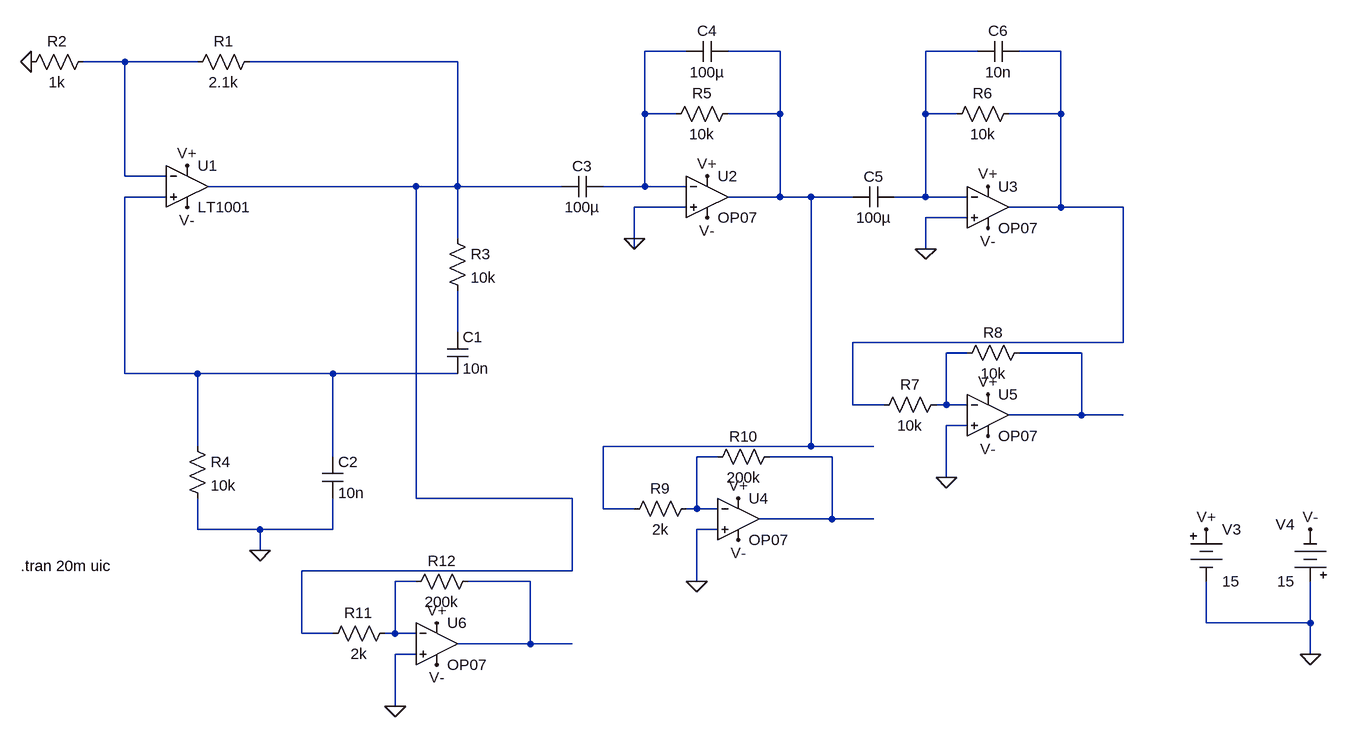
[diagram p0: schematic functiongenerator.asc]
functiongenerator.asc, the LTspice schematic file:
Version 4.1
SHEET 1 1992 964
WIRE 944 -64 880 -64
WIRE 1088 -64 1008 -64
WIRE 1392 -64 1312 -64
WIRE 1520 -64 1456 -64
WIRE 80 -48 16 -48
WIRE 192 -48 80 -48
WIRE 592 -48 272 -48
WIRE 880 32 880 -64
WIRE 928 32 880 32
WIRE 1088 32 1088 -64
WIRE 1088 32 1008 32
WIRE 1312 32 1312 -64
WIRE 1360 32 1312 32
WIRE 1520 32 1520 -64
WIRE 1520 32 1440 32
WIRE 80 128 80 -48
WIRE 144 128 80 128
WIRE 528 144 208 144
WIRE 592 144 592 -48
WIRE 592 144 528 144
WIRE 752 144 592 144
WIRE 880 144 880 32
WIRE 880 144 816 144
WIRE 944 144 880 144
WIRE 144 160 80 160
WIRE 1088 160 1088 32
WIRE 1088 160 1008 160
WIRE 1136 160 1088 160
WIRE 1200 160 1136 160
WIRE 1312 160 1312 32
WIRE 1312 160 1264 160
WIRE 1376 160 1312 160
WIRE 944 176 864 176
WIRE 1520 176 1520 32
WIRE 1520 176 1440 176
WIRE 1616 176 1520 176
WIRE 1376 192 1312 192
WIRE 592 224 592 144
WIRE 864 224 864 176
WIRE 864 240 864 224
WIRE 1312 240 1312 192
WIRE 592 368 592 304
WIRE 1616 384 1616 176
WIRE 1616 384 1200 384
WIRE 1376 400 1344 400
WIRE 1552 400 1456 400
WIRE 80 432 80 160
WIRE 192 432 80 432
WIRE 400 432 192 432
WIRE 592 432 400 432
WIRE 1200 480 1200 384
WIRE 1248 480 1200 480
WIRE 1344 480 1344 400
WIRE 1344 480 1328 480
WIRE 1376 480 1344 480
WIRE 1552 496 1552 400
WIRE 1552 496 1440 496
WIRE 1616 496 1552 496
WIRE 1376 512 1344 512
WIRE 192 544 192 432
WIRE 1136 544 1136 160
WIRE 1136 544 816 544
WIRE 1232 544 1136 544
WIRE 400 560 400 432
WIRE 992 560 960 560
WIRE 1168 560 1072 560
WIRE 1344 592 1344 512
WIRE 528 624 528 144
WIRE 768 624 528 624
WIRE 816 640 816 544
WIRE 864 640 816 640
WIRE 960 640 960 560
WIRE 960 640 944 640
WIRE 992 640 960 640
WIRE 1168 656 1168 560
WIRE 1168 656 1056 656
WIRE 1232 656 1168 656
WIRE 192 672 192 624
WIRE 288 672 192 672
WIRE 400 672 400 624
WIRE 400 672 288 672
WIRE 992 672 960 672
WIRE 288 704 288 672
WIRE 768 736 768 624
WIRE 768 736 352 736
WIRE 528 752 496 752
WIRE 704 752 608 752
WIRE 960 752 960 672
WIRE 1744 816 1744 752
WIRE 1904 816 1904 752
WIRE 1904 816 1744 816
WIRE 352 832 352 736
WIRE 400 832 352 832
WIRE 496 832 496 752
WIRE 496 832 480 832
WIRE 528 832 496 832
WIRE 704 848 704 752
WIRE 704 848 592 848
WIRE 768 848 704 848
WIRE 528 864 496 864
WIRE 1904 864 1904 816
WIRE 496 944 496 864
FLAG -64 -48 0
FLAG 288 704 0
FLAG 864 224 0
FLAG 1744 672 V+
FLAG 976 128 V+
FLAG 1904 672 V-
FLAG 976 192 V-
FLAG 1904 864 0
FLAG 1312 240 0
FLAG 1408 144 V+
FLAG 1408 208 V-
FLAG 1344 592 0
FLAG 1408 464 V+
FLAG 1408 528 V-
FLAG 960 752 0
FLAG 1024 624 V+
FLAG 1024 688 V-
FLAG 496 944 0
FLAG 560 816 V+
FLAG 560 880 V-
FLAG 176 112 V+
FLAG 176 176 V-
SYMBOL OpAmps\\LT1001 176 80 R0
SYMATTR InstName U1
SYMBOL res 288 -64 R90
WINDOW 0 0 56 VBottom 2
WINDOW 3 32 56 VTop 2
SYMATTR InstName R1
SYMATTR Value 2.1k
SYMBOL res 32 -64 R90
WINDOW 0 0 56 VBottom 2
WINDOW 3 32 56 VTop 2
SYMATTR InstName R2
SYMATTR Value 1k
SYMBOL res 576 208 R0
SYMATTR InstName R3
SYMATTR Value 10k
SYMBOL cap 576 368 R0
SYMATTR InstName C1
SYMATTR Value 10n
SYMBOL res 176 528 R0
SYMATTR InstName R4
SYMATTR Value 10k
SYMBOL cap 384 560 R0
SYMATTR InstName C2
SYMATTR Value 10n
SYMBOL OpAmps\\OP07 976 96 R0
SYMATTR InstName U2
SYMBOL cap 816 128 R90
WINDOW 0 0 32 VBottom 2
WINDOW 3 32 32 VTop 2
SYMATTR InstName C3
SYMATTR Value 100µ
SYMBOL res 1024 16 R90
WINDOW 0 0 56 VBottom 2
WINDOW 3 32 56 VTop 2
SYMATTR InstName R5
SYMATTR Value 10k
SYMBOL Misc\\battery 1744 656 R0
WINDOW 123 0 0 Left 0
WINDOW 39 0 0 Left 0
SYMATTR InstName V3
SYMATTR Value 15
SYMBOL cap 1008 -80 R90
WINDOW 0 0 32 VBottom 2
WINDOW 3 32 32 VTop 2
SYMATTR InstName C4
SYMATTR Value 100µ
SYMBOL cap 1264 144 R90
WINDOW 0 0 32 VBottom 2
WINDOW 3 32 32 VTop 2
SYMATTR InstName C5
SYMATTR Value 100µ
SYMBOL OpAmps\\OP07 1408 112 R0
SYMATTR InstName U3
SYMBOL res 1456 16 R90
WINDOW 0 0 56 VBottom 2
WINDOW 3 32 56 VTop 2
SYMATTR InstName R6
SYMATTR Value 10k
SYMBOL cap 1456 -80 R90
WINDOW 0 0 32 VBottom 2
WINDOW 3 32 32 VTop 2
SYMATTR InstName C6
SYMATTR Value 10n
SYMBOL OpAmps\\OP07 1408 432 R0
SYMATTR InstName U5
SYMBOL res 1344 464 R90
WINDOW 0 0 56 VBottom 2
WINDOW 3 32 56 VTop 2
SYMATTR InstName R7
SYMATTR Value 10k
SYMBOL res 1472 384 R90
WINDOW 0 0 56 VBottom 2
WINDOW 3 32 56 VTop 2
SYMATTR InstName R8
SYMATTR Value 10k
SYMBOL OpAmps\\OP07 1024 592 R0
SYMATTR InstName U4
SYMBOL res 960 624 R90
WINDOW 0 0 56 VBottom 2
WINDOW 3 32 56 VTop 2
SYMATTR InstName R9
SYMATTR Value 2k
SYMBOL res 1088 544 R90
WINDOW 0 0 56 VBottom 2
WINDOW 3 32 56 VTop 2
SYMATTR InstName R10
SYMATTR Value 200k
SYMBOL OpAmps\\OP07 560 784 R0
SYMATTR InstName U6
SYMBOL res 496 816 R90
WINDOW 0 0 56 VBottom 2
WINDOW 3 32 56 VTop 2
SYMATTR InstName R11
SYMATTR Value 2k
SYMBOL res 624 736 R90
WINDOW 0 0 56 VBottom 2
WINDOW 3 32 56 VTop 2
SYMATTR InstName R12
SYMATTR Value 200k
SYMBOL Misc\\battery 1904 768 R180
WINDOW 0 24 104 Left 2
WINDOW 3 24 16 Left 2
WINDOW 123 0 0 Left 0
WINDOW 39 0 0 Left 0
SYMATTR InstName V4
SYMATTR Value 15
TEXT -80 728 Left 2 !.tran 20m uic

The netlist it stands for:
* functiongenerator.asc
X§U1 N007 N005 V+ V- N006 LT1001  ; pins In+ In- V+ V- OUT
R1 N006 N005 2.1k
R2 N005 0 1k
R3 N006 N008 10k
C1 N008 N007 10n
R4 N007 0 10k
C2 N007 0 10n
X§U2 0 N001 V+ V- N002 LT1001  ; OP07, pins In+ In- V+ V- OUT
C3 N001 N006 100µ
R5 N002 N001 10k
V3 V+ 0 15
C4 N002 N001 100µ
C5 N003 N002 100µ
X§U3 0 N003 V+ V- N004 LT1001  ; OP07, pins In+ In- V+ V- OUT
R6 N004 N003 10k
C6 N004 N003 10n
X§U5 0 N009 V+ V- N010 LT1001  ; OP07, pins In+ In- V+ V- OUT
R7 N009 N004 10k
R8 N010 N009 10k
X§U4 0 N011 V+ V- N012 LT1001  ; OP07, pins In+ In- V+ V- OUT
R9 N011 N002 2k
R10 N012 N011 200k
X§U6 0 N013 V+ V- N014 LT1001  ; OP07, pins In+ In- V+ V- OUT
R11 N013 N006 2k
R12 N014 N013 200k
V4 0 V- 15
.tran 20m uic
.lib LTC.lib
.backanno
.end